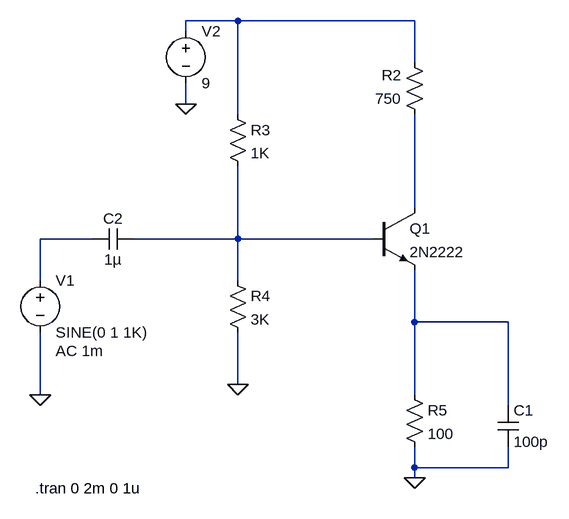
[diagram p0: schematic Draft19.asc]
Draft19.asc, the LTspice schematic file:
Version 4
SHEET 1 888 680
WIRE 400 -256 320 -256
WIRE 672 -256 400 -256
WIRE 320 -240 320 -256
WIRE 672 -192 672 -256
WIRE 320 -128 320 -160
WIRE 400 -112 400 -256
WIRE 672 32 672 -112
WIRE 176 80 96 80
WIRE 400 80 400 -32
WIRE 400 80 240 80
WIRE 608 80 400 80
WIRE 96 144 96 80
WIRE 400 144 400 80
WIRE 672 208 672 128
WIRE 816 208 672 208
WIRE 400 304 400 224
WIRE 96 320 96 224
WIRE 672 320 672 208
WIRE 816 336 816 208
WIRE 672 432 672 400
WIRE 816 432 816 400
WIRE 816 432 672 432
WIRE 672 448 672 432
FLAG 96 320 0
FLAG 672 448 0
FLAG 320 -128 0
FLAG 400 304 0
DATAFLAG 400 80 ""
DATAFLAG 672 -80 ""
DATAFLAG 672 160 ""
SYMBOL voltage 96 128 R0
WINDOW 123 24 124 Left 2
WINDOW 39 0 0 Left 0
SYMATTR InstName V1
SYMATTR Value SINE(0 1 1K)
SYMATTR Value2 AC 1m
SYMBOL voltage 320 -256 R0
SYMATTR InstName V2
SYMATTR Value 9
SYMBOL npn 608 32 R0
SYMATTR InstName Q1
SYMATTR Value 2N2222
SYMBOL res 688 -96 R180
WINDOW 0 36 76 Left 2
WINDOW 3 36 40 Left 2
SYMATTR InstName R2
SYMATTR Value 750
SYMBOL res 384 -128 R0
SYMATTR InstName R3
SYMATTR Value 1K
SYMBOL res 384 128 R0
SYMATTR InstName R4
SYMATTR Value 3K
SYMBOL res 656 304 R0
SYMATTR InstName R5
SYMATTR Value 100
SYMBOL cap 800 336 R0
SYMATTR InstName C1
SYMATTR Value 100p
SYMBOL cap 240 64 R90
WINDOW 0 0 32 VBottom 2
WINDOW 3 32 32 VTop 2
SYMATTR InstName C2
SYMATTR Value 1µ
TEXT 88 464 Left 2 !.tran 0 2m 0 1u

The netlist it stands for:
* Draft19.asc
V1 N003 0 SINE(0 1 1K) AC 1m
V2 N001 0 9
Q1 N002 N004 N005 0 2N2222
R2 N002 N001 750
R3 N001 N004 1K
R4 N004 0 3K
R5 N005 0 100
C1 N005 0 100p
C2 N004 N003 1µ
.model NPN NPN
.model PNP PNP
.lib standard.bjt
.tran 0 2m 0 1u
.backanno
.end